# EAGLE schematic rover_main_supply_board (EAGLE 9.6.2)
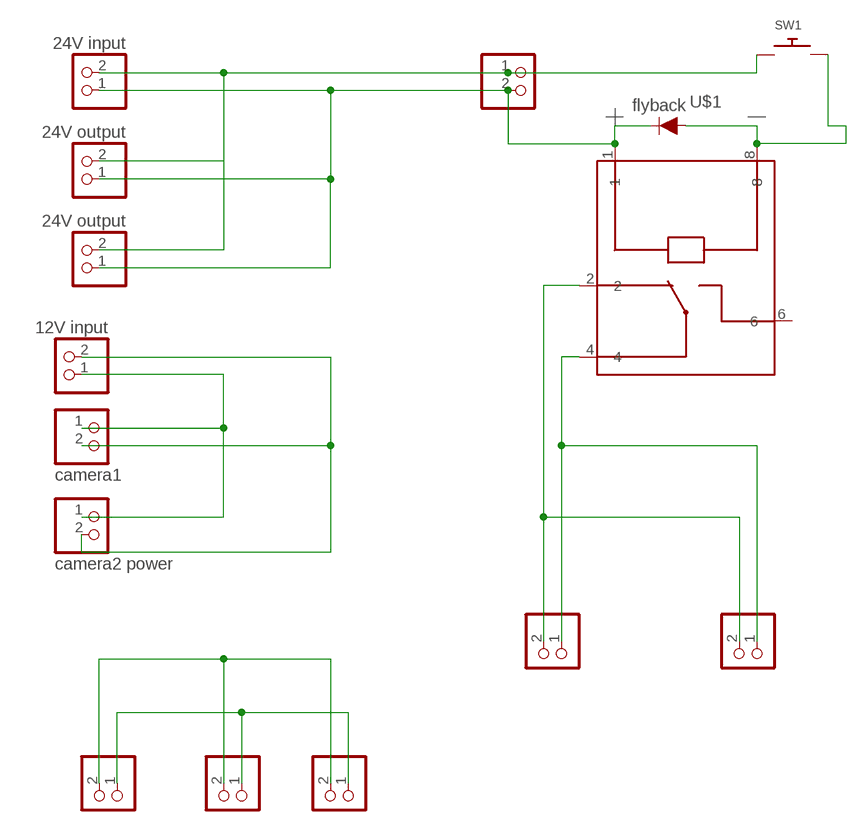
[diagram p0: schematic, sheet 1]

## Parts
5VINPUT  5V INPUT  PINHD-1X2  [1X02]
D1  flyback  DIODE-1N4148  [DIODE-1N4148]
JP1  24V input  PINHD-1X2  [1X02]
JP2  PINHD-1X2  [1X02]
JP3  PINHD-1X2  [1X02]
JP4  PINHD-1X2  [1X02]
JP5  camera1  PINHD-1X2  [1X02]
JP6  camera2 power  PINHD-1X2  [1X02]
JP7  24V output  PINHD-1X2  [1X02]
JP8  12V input  PINHD-1X2  [1X02]
JP9  camera2 power  PINHD-1X2  [1X02]
JP10  camera2 power  PINHD-1X2  [1X02]
JP11  24V output  PINHD-1X2  [1X02]
SW1  SWITCH_PUSHBUTTONSOFTTOUCHSMD_SJ  [PUSHBUTTON_SMD_SJ]
U$1  ADJ1505005  [DJ_1_FORM_C_SSS]

## Nets
N$1: JP1.2 JP2.1 JP7.2 SW1.P$1
N$2: 5VINPUT.1 JP9.1 JP10.1
N$3: D1.A SW1.P$2 U$1.8
N$4: JP3.2 JP4.2 U$1.2
N$5: JP3.1 JP4.1 U$1.4
N$6: JP5.2 JP6.2 JP8.2
N$7: JP5.1 JP6.1 JP8.1
N$8: JP11.2
N$9: D1.C JP1.1 JP2.2 JP7.1 JP11.1 U$1.1
N$10: 5VINPUT.2 JP9.2 JP10.2
Unconnected: U$1.6

## Library data of the parts
5VINPUT JP1-JP11 = pinhead:PINHD-1X2: PIN HEADER
D1 = SparkFun-DiscreteSemi:DIODE: Diode These are standard reverse protection diodes and small signal diodes. SparkFun Products: SparkFun SparkPunk Sound Kit <https://www.sparkfun.com/products/11177> SparkFun ESP8266 Thing <https://www.sparkfun.com/products/13231>; PROD_ID: DIO-08378; VALUE: 200mA/100V/1V
SW1 = adafruit:SWITCH_PUSHBUTTON: Buttons SOFTTOUCHSMD_SJ - Soft touch temporary push button (Super Junk Akihabara) Compatible with SKPMANE010 [Mouser: 688-SKPMAN] C&K_KSS = Digikey: KSS221GLFS
U$1 = Panasonic Relay:ADJ150: DJ - 1 Form C - Single side stable, Flux-resistant type - without a test button Data sheet <https://www.panasonic-electric-works.com/eu/download.htm?id=55823> Parameters Max. switching voltage: 230V DC, 440V AC Max. switching current: 8 A / 16 A Operational function: Single side stable, 1 coil latching, 2 coil latching Contact arrangement: 1 NO / 2 NO / 1 NO 1 NC Applications Temperature controller Automatic meter reading OA equipment FA equipment Options Also available as 1 coil latching and 2 coil latching version, each as RT II and RT III type and with or without a test button. Annotation: The protection category (RT 0 - RT V) describes the degree of sealing the relay's case or it's contact unit.; U_COIL: 5V DC